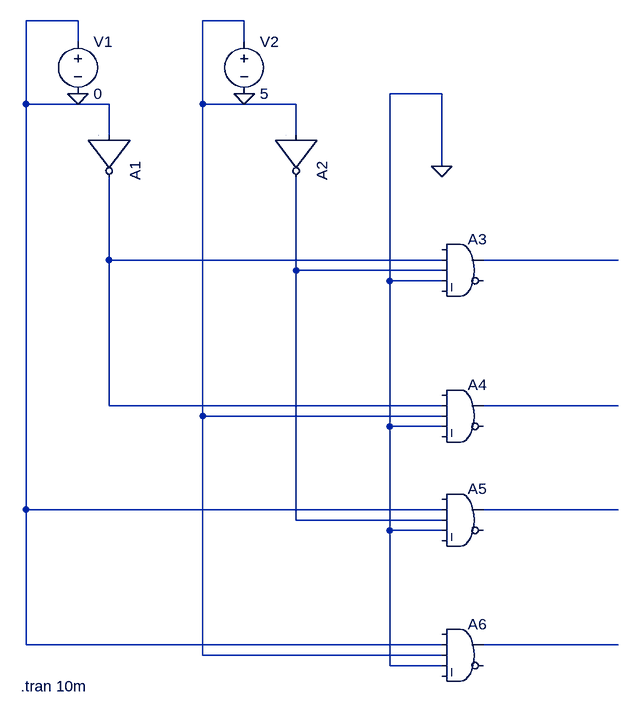
[diagram p0: schematic demux.asc]
demux.asc, the LTspice schematic file:
Version 4.1
SHEET 1 948 1220
WIRE 112 0 32 0
WIRE 368 0 304 0
WIRE 112 32 112 0
WIRE 368 32 368 0
WIRE 672 112 592 112
WIRE 32 128 32 0
WIRE 160 128 32 128
WIRE 304 128 304 0
WIRE 448 128 304 128
WIRE 160 176 160 128
WIRE 448 176 448 128
WIRE 672 224 672 112
WIRE 160 368 160 240
WIRE 672 368 160 368
WIRE 944 368 736 368
WIRE 448 384 448 240
WIRE 672 384 448 384
WIRE 592 400 592 112
WIRE 672 400 592 400
WIRE 160 592 160 368
WIRE 672 592 160 592
WIRE 944 592 736 592
WIRE 304 608 304 128
WIRE 672 608 304 608
WIRE 592 624 592 400
WIRE 672 624 592 624
WIRE 32 752 32 128
WIRE 672 752 32 752
WIRE 944 752 736 752
WIRE 448 768 448 384
WIRE 672 768 448 768
WIRE 592 784 592 624
WIRE 672 784 592 784
WIRE 32 960 32 752
WIRE 672 960 32 960
WIRE 944 960 736 960
WIRE 304 976 304 608
WIRE 672 976 304 976
WIRE 592 992 592 784
WIRE 672 992 592 992
FLAG 672 224 0
FLAG 112 112 0
FLAG 368 112 0
SYMBOL voltage 112 16 R0
WINDOW 123 0 0 Left 0
WINDOW 39 0 0 Left 0
SYMATTR InstName V1
SYMATTR Value 0
SYMBOL voltage 368 16 R0
WINDOW 123 0 0 Left 0
WINDOW 39 0 0 Left 0
SYMATTR InstName V2
SYMATTR Value 5
SYMBOL Digital\\inv 224 176 R90
SYMATTR InstName A1
SYMBOL Digital\\inv 512 176 R90
SYMATTR InstName A2
SYMBOL Digital\\and 704 320 R0
SYMATTR InstName A3
SYMBOL Digital\\and 704 544 R0
SYMATTR InstName A4
SYMBOL Digital\\and 704 704 R0
SYMATTR InstName A5
SYMBOL Digital\\and 704 912 R0
SYMATTR InstName A6
TEXT 24 1024 Left 2 !.tran 10m

The netlist it stands for:
* demux.asc
V1 N001 0 0
V2 N002 0 5
A1 N001 0 0 0 0 N003 0 0 BUF
A2 N002 0 0 0 0 N005 0 0 BUF
A3 0 N003 N005 0 0 0 N004 0 AND
A4 0 N003 N002 0 0 0 N006 0 AND
A5 0 N001 N005 0 0 0 N007 0 AND
A6 0 N001 N002 0 0 0 N008 0 AND
.tran 10m
.backanno
.end